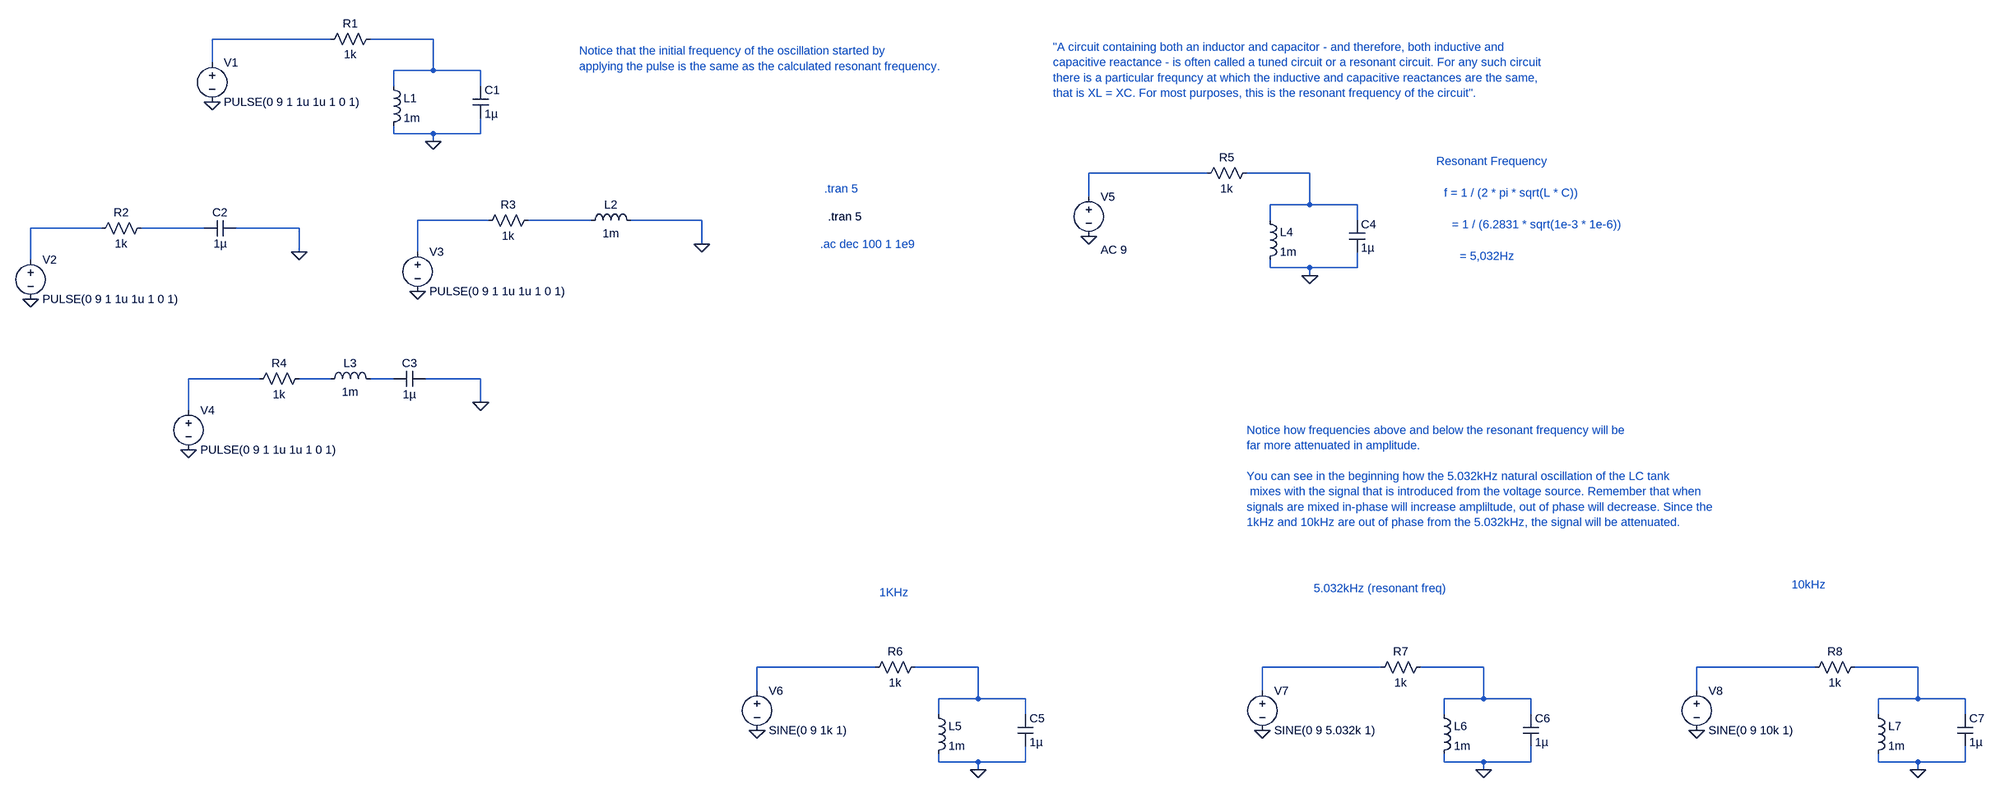
[diagram p0: schematic LC Oscillator.asc]
LC Oscillator.asc, the LTspice schematic file:
Version 4
SHEET 1 3528 1636
WIRE 176 80 -64 80
WIRE 384 80 256 80
WIRE -64 128 -64 80
WIRE 384 144 384 80
WIRE 384 144 304 144
WIRE 480 144 384 144
WIRE 304 176 304 144
WIRE 480 176 480 144
WIRE 304 272 304 256
WIRE 384 272 304 272
WIRE 480 272 480 240
WIRE 480 272 384 272
WIRE 384 288 384 272
WIRE 1952 352 1712 352
WIRE 2160 352 2032 352
WIRE 1712 400 1712 352
WIRE 2160 416 2160 352
WIRE 2160 416 2080 416
WIRE 2256 416 2160 416
WIRE 496 448 352 448
WIRE 704 448 576 448
WIRE 928 448 784 448
WIRE 2080 448 2080 416
WIRE 2256 448 2256 416
WIRE -288 464 -432 464
WIRE -80 464 -208 464
WIRE 112 464 -16 464
WIRE 928 496 928 448
WIRE 112 512 112 464
WIRE 352 512 352 448
WIRE -432 528 -432 464
WIRE 2080 544 2080 528
WIRE 2160 544 2080 544
WIRE 2256 544 2256 512
WIRE 2256 544 2160 544
WIRE 2160 560 2160 544
WIRE 32 816 -112 816
WIRE 176 816 112 816
WIRE 304 816 256 816
WIRE 480 816 368 816
WIRE 480 864 480 816
WIRE -112 880 -112 816
WIRE 1280 1408 1040 1408
WIRE 1488 1408 1360 1408
WIRE 2304 1408 2064 1408
WIRE 2512 1408 2384 1408
WIRE 3184 1408 2944 1408
WIRE 3392 1408 3264 1408
WIRE 1040 1456 1040 1408
WIRE 2064 1456 2064 1408
WIRE 2944 1456 2944 1408
WIRE 1488 1472 1488 1408
WIRE 1488 1472 1408 1472
WIRE 1584 1472 1488 1472
WIRE 2512 1472 2512 1408
WIRE 2512 1472 2432 1472
WIRE 2608 1472 2512 1472
WIRE 3392 1472 3392 1408
WIRE 3392 1472 3312 1472
WIRE 3488 1472 3392 1472
WIRE 1408 1504 1408 1472
WIRE 1584 1504 1584 1472
WIRE 2432 1504 2432 1472
WIRE 2608 1504 2608 1472
WIRE 3312 1504 3312 1472
WIRE 3488 1504 3488 1472
WIRE 1408 1600 1408 1584
WIRE 1488 1600 1408 1600
WIRE 1584 1600 1584 1568
WIRE 1584 1600 1488 1600
WIRE 2432 1600 2432 1584
WIRE 2512 1600 2432 1600
WIRE 2608 1600 2608 1568
WIRE 2608 1600 2512 1600
WIRE 3312 1600 3312 1584
WIRE 3392 1600 3312 1600
WIRE 3488 1600 3488 1568
WIRE 3488 1600 3392 1600
WIRE 1488 1616 1488 1600
WIRE 2512 1616 2512 1600
WIRE 3392 1616 3392 1600
FLAG -64 208 0
FLAG 384 288 0
FLAG -432 608 0
FLAG 112 512 0
FLAG 352 592 0
FLAG 928 496 0
FLAG -112 960 0
FLAG 480 864 0
FLAG 1712 480 0
FLAG 2160 560 0
FLAG 1040 1536 0
FLAG 1488 1616 0
FLAG 2064 1536 0
FLAG 2512 1616 0
FLAG 2944 1536 0
FLAG 3392 1616 0
SYMBOL voltage -64 112 R0
WINDOW 123 0 0 Left 0
WINDOW 39 0 0 Left 0
SYMATTR InstName V1
SYMATTR Value PULSE(0 9 1 1u 1u 1 0 1)
SYMBOL res 160 96 R270
WINDOW 0 32 56 VTop 2
WINDOW 3 0 56 VBottom 2
SYMATTR InstName R1
SYMATTR Value 1k
SYMBOL ind 288 160 R0
SYMATTR InstName L1
SYMATTR Value 1m
SYMBOL cap 464 176 R0
SYMATTR InstName C1
SYMATTR Value 1µ
SYMBOL voltage -432 512 R0
WINDOW 123 0 0 Left 0
WINDOW 39 0 0 Left 0
SYMATTR InstName V2
SYMATTR Value PULSE(0 9 1 1u 1u 1 0 1)
SYMBOL res -304 480 R270
WINDOW 0 32 56 VTop 2
WINDOW 3 0 56 VBottom 2
SYMATTR InstName R2
SYMATTR Value 1k
SYMBOL cap -80 480 R270
WINDOW 0 32 32 VTop 2
WINDOW 3 0 32 VBottom 2
SYMATTR InstName C2
SYMATTR Value 1µ
SYMBOL voltage 352 496 R0
WINDOW 123 0 0 Left 0
WINDOW 39 0 0 Left 0
SYMATTR InstName V3
SYMATTR Value PULSE(0 9 1 1u 1u 1 0 1)
SYMBOL res 480 464 R270
WINDOW 0 32 56 VTop 2
WINDOW 3 0 56 VBottom 2
SYMATTR InstName R3
SYMATTR Value 1k
SYMBOL ind 688 464 R270
WINDOW 0 32 56 VTop 2
WINDOW 3 5 56 VBottom 2
SYMATTR InstName L2
SYMATTR Value 1m
SYMBOL voltage -112 864 R0
WINDOW 123 0 0 Left 0
WINDOW 39 0 0 Left 0
SYMATTR InstName V4
SYMATTR Value PULSE(0 9 1 1u 1u 1 0 1)
SYMBOL res 16 832 R270
WINDOW 0 32 56 VTop 2
WINDOW 3 0 56 VBottom 2
SYMATTR InstName R4
SYMATTR Value 1k
SYMBOL cap 304 832 R270
WINDOW 0 32 32 VTop 2
WINDOW 3 0 32 VBottom 2
SYMATTR InstName C3
SYMATTR Value 1µ
SYMBOL ind 160 832 R270
WINDOW 0 32 56 VTop 2
WINDOW 3 5 56 VBottom 2
SYMATTR InstName L3
SYMATTR Value 1m
SYMBOL voltage 1712 384 R0
WINDOW 123 24 124 Left 2
WINDOW 39 0 0 Left 0
SYMATTR Value2 AC 9
SYMATTR InstName V5
SYMATTR Value ""
SYMBOL res 1936 368 R270
WINDOW 0 32 56 VTop 2
WINDOW 3 0 56 VBottom 2
SYMATTR InstName R5
SYMATTR Value 1k
SYMBOL ind 2064 432 R0
SYMATTR InstName L4
SYMATTR Value 1m
SYMBOL cap 2240 448 R0
SYMATTR InstName C4
SYMATTR Value 1µ
SYMBOL voltage 1040 1440 R0
WINDOW 123 0 0 Left 0
WINDOW 39 0 0 Left 0
SYMATTR InstName V6
SYMATTR Value SINE(0 9 1k 1)
SYMBOL res 1264 1424 R270
WINDOW 0 32 56 VTop 2
WINDOW 3 0 56 VBottom 2
SYMATTR InstName R6
SYMATTR Value 1k
SYMBOL ind 1392 1488 R0
SYMATTR InstName L5
SYMATTR Value 1m
SYMBOL cap 1568 1504 R0
SYMATTR InstName C5
SYMATTR Value 1µ
SYMBOL voltage 2064 1440 R0
WINDOW 123 0 0 Left 0
WINDOW 39 0 0 Left 0
SYMATTR InstName V7
SYMATTR Value SINE(0 9 5.032k 1)
SYMBOL res 2288 1424 R270
WINDOW 0 32 56 VTop 2
WINDOW 3 0 56 VBottom 2
SYMATTR InstName R7
SYMATTR Value 1k
SYMBOL ind 2416 1488 R0
SYMATTR InstName L6
SYMATTR Value 1m
SYMBOL cap 2592 1504 R0
SYMATTR InstName C6
SYMATTR Value 1µ
SYMBOL voltage 2944 1440 R0
WINDOW 123 0 0 Left 0
WINDOW 39 0 0 Left 0
SYMATTR InstName V8
SYMATTR Value SINE(0 9 10k 1)
SYMBOL res 3168 1424 R270
WINDOW 0 32 56 VTop 2
WINDOW 3 0 56 VBottom 2
SYMATTR InstName R8
SYMATTR Value 1k
SYMBOL ind 3296 1488 R0
SYMATTR InstName L7
SYMATTR Value 1m
SYMBOL cap 3472 1504 R0
SYMATTR InstName C7
SYMATTR Value 1µ
TEXT 1184 440 Left 2 !.tran 5
TEXT 1176 384 Left 2 ;.tran 5
TEXT 1168 496 Left 2 ;.ac dec 100 1 1e9
TEXT 2416 328 Left 2 ;Resonant Frequency
TEXT 2432 392 Left 2 ;f = 1 / (2 * pi * sqrt(L * C))
TEXT 2448 456 Left 2 ;= 1 / (6.2831 * sqrt(1e-3 * 1e-6))
TEXT 1640 96 Left 2 ;"A circuit containing both an inductor and capacitor - and therefore, both inductive and\ncapacitive reactance - is often called a tuned circuit or a resonant circuit. For any such circuit\nthere is a particular frequncy at which the inductive and capacitive reactances are the same,\nthat is XL = XC. For most purposes, this is the resonant frequency of the circuit".
TEXT 2464 520 Left 2 ;= 5,032Hz
TEXT 680 104 Left 2 ;Notice that the initial frequency of the oscillation started by\napplying the pulse is the same as the calculated resonant frequency.
TEXT 1288 1256 Left 2 ;1KHz
TEXT 2168 1248 Left 2 ;5.032kHz (resonant freq)
TEXT 2032 920 Left 2 ;Notice how frequencies above and below the resonant frequency will be\nfar more attenuated in amplitude. \n \nYou can see in the beginning how the 5.032kHz natural oscillation of the LC tank\n mixes with the signal that is introduced from the voltage source. Remember that when\nsignals are mixed in-phase will increase ampliltude, out of phase will decrease. Since the\n1kHz and 10kHz are out of phase from the 5.032kHz, the signal will be attenuated.
TEXT 3136 1240 Left 2 ;10kHz

The netlist it stands for:
* LC Oscillator.asc
V1 N001 0 PULSE(0 9 1 1u 1u 1 0 1)
R1 N001 N002 1k
L1 N002 0 1m
C1 N002 0 1µ
V2 N007 0 PULSE(0 9 1 1u 1u 1 0 1)
R2 N007 N008 1k
C2 N008 0 1µ
V3 N005 0 PULSE(0 9 1 1u 1u 1 0 1)
R3 N005 N006 1k
L2 N006 0 1m
V4 N009 0 PULSE(0 9 1 1u 1u 1 0 1)
R4 N009 N010 1k
C3 N011 0 1µ
L3 N010 N011 1m
V5 N003 0 AC 9
R5 N003 N004 1k
L4 N004 0 1m
C4 N004 0 1µ
V6 N012 0 SINE(0 9 1k 1)
R6 N012 N013 1k
L5 N013 0 1m
C5 N013 0 1µ
V7 N014 0 SINE(0 9 5.032k 1)
R7 N014 N015 1k
L6 N015 0 1m
C6 N015 0 1µ
V8 N016 0 SINE(0 9 10k 1)
R8 N016 N017 1k
L7 N017 0 1m
C7 N017 0 1µ
.tran 5
* .tran 5
* .ac dec 100 1 1e9
* Resonant Frequency
* f = 1 / (2 * pi * sqrt(L * C))
* = 1 / (6.2831 * sqrt(1e-3 * 1e-6))
* "A circuit containing both an inductor and capacitor - and therefore, both inductive and
* capacitive reactance - is often called a tuned circuit or a resonant circuit. For any such circuit
* there is a particular frequncy at which the inductive and capacitive reactances are the same,
* that is XL = XC. For most purposes, this is the resonant frequency of the circuit".
* = 5,032Hz
* Notice that the initial frequency of the oscillation started by
* applying the pulse is the same as the calculated resonant frequency.
* 1KHz
* 5.032kHz (resonant freq)
* Notice how frequencies above and below the resonant frequency will be
* far more attenuated in amplitude.
* You can see in the beginning how the 5.032kHz natural oscillation of the LC tank
*  mixes with the signal that is introduced from the voltage source. Remember that when
* signals are mixed in-phase will increase ampliltude, out of phase will decrease. Since the
* 1kHz and 10kHz are out of phase from the 5.032kHz, the signal will be attenuated.
* 10kHz
.backanno
.end